# EasyEDA schematic SCH_usb_board_2025-01-15.json
TITLE: usb_board; REV: 1.0; Date: 2025-01-14; Sheet: 1/1; Company: Gymnazium Jana Keplera
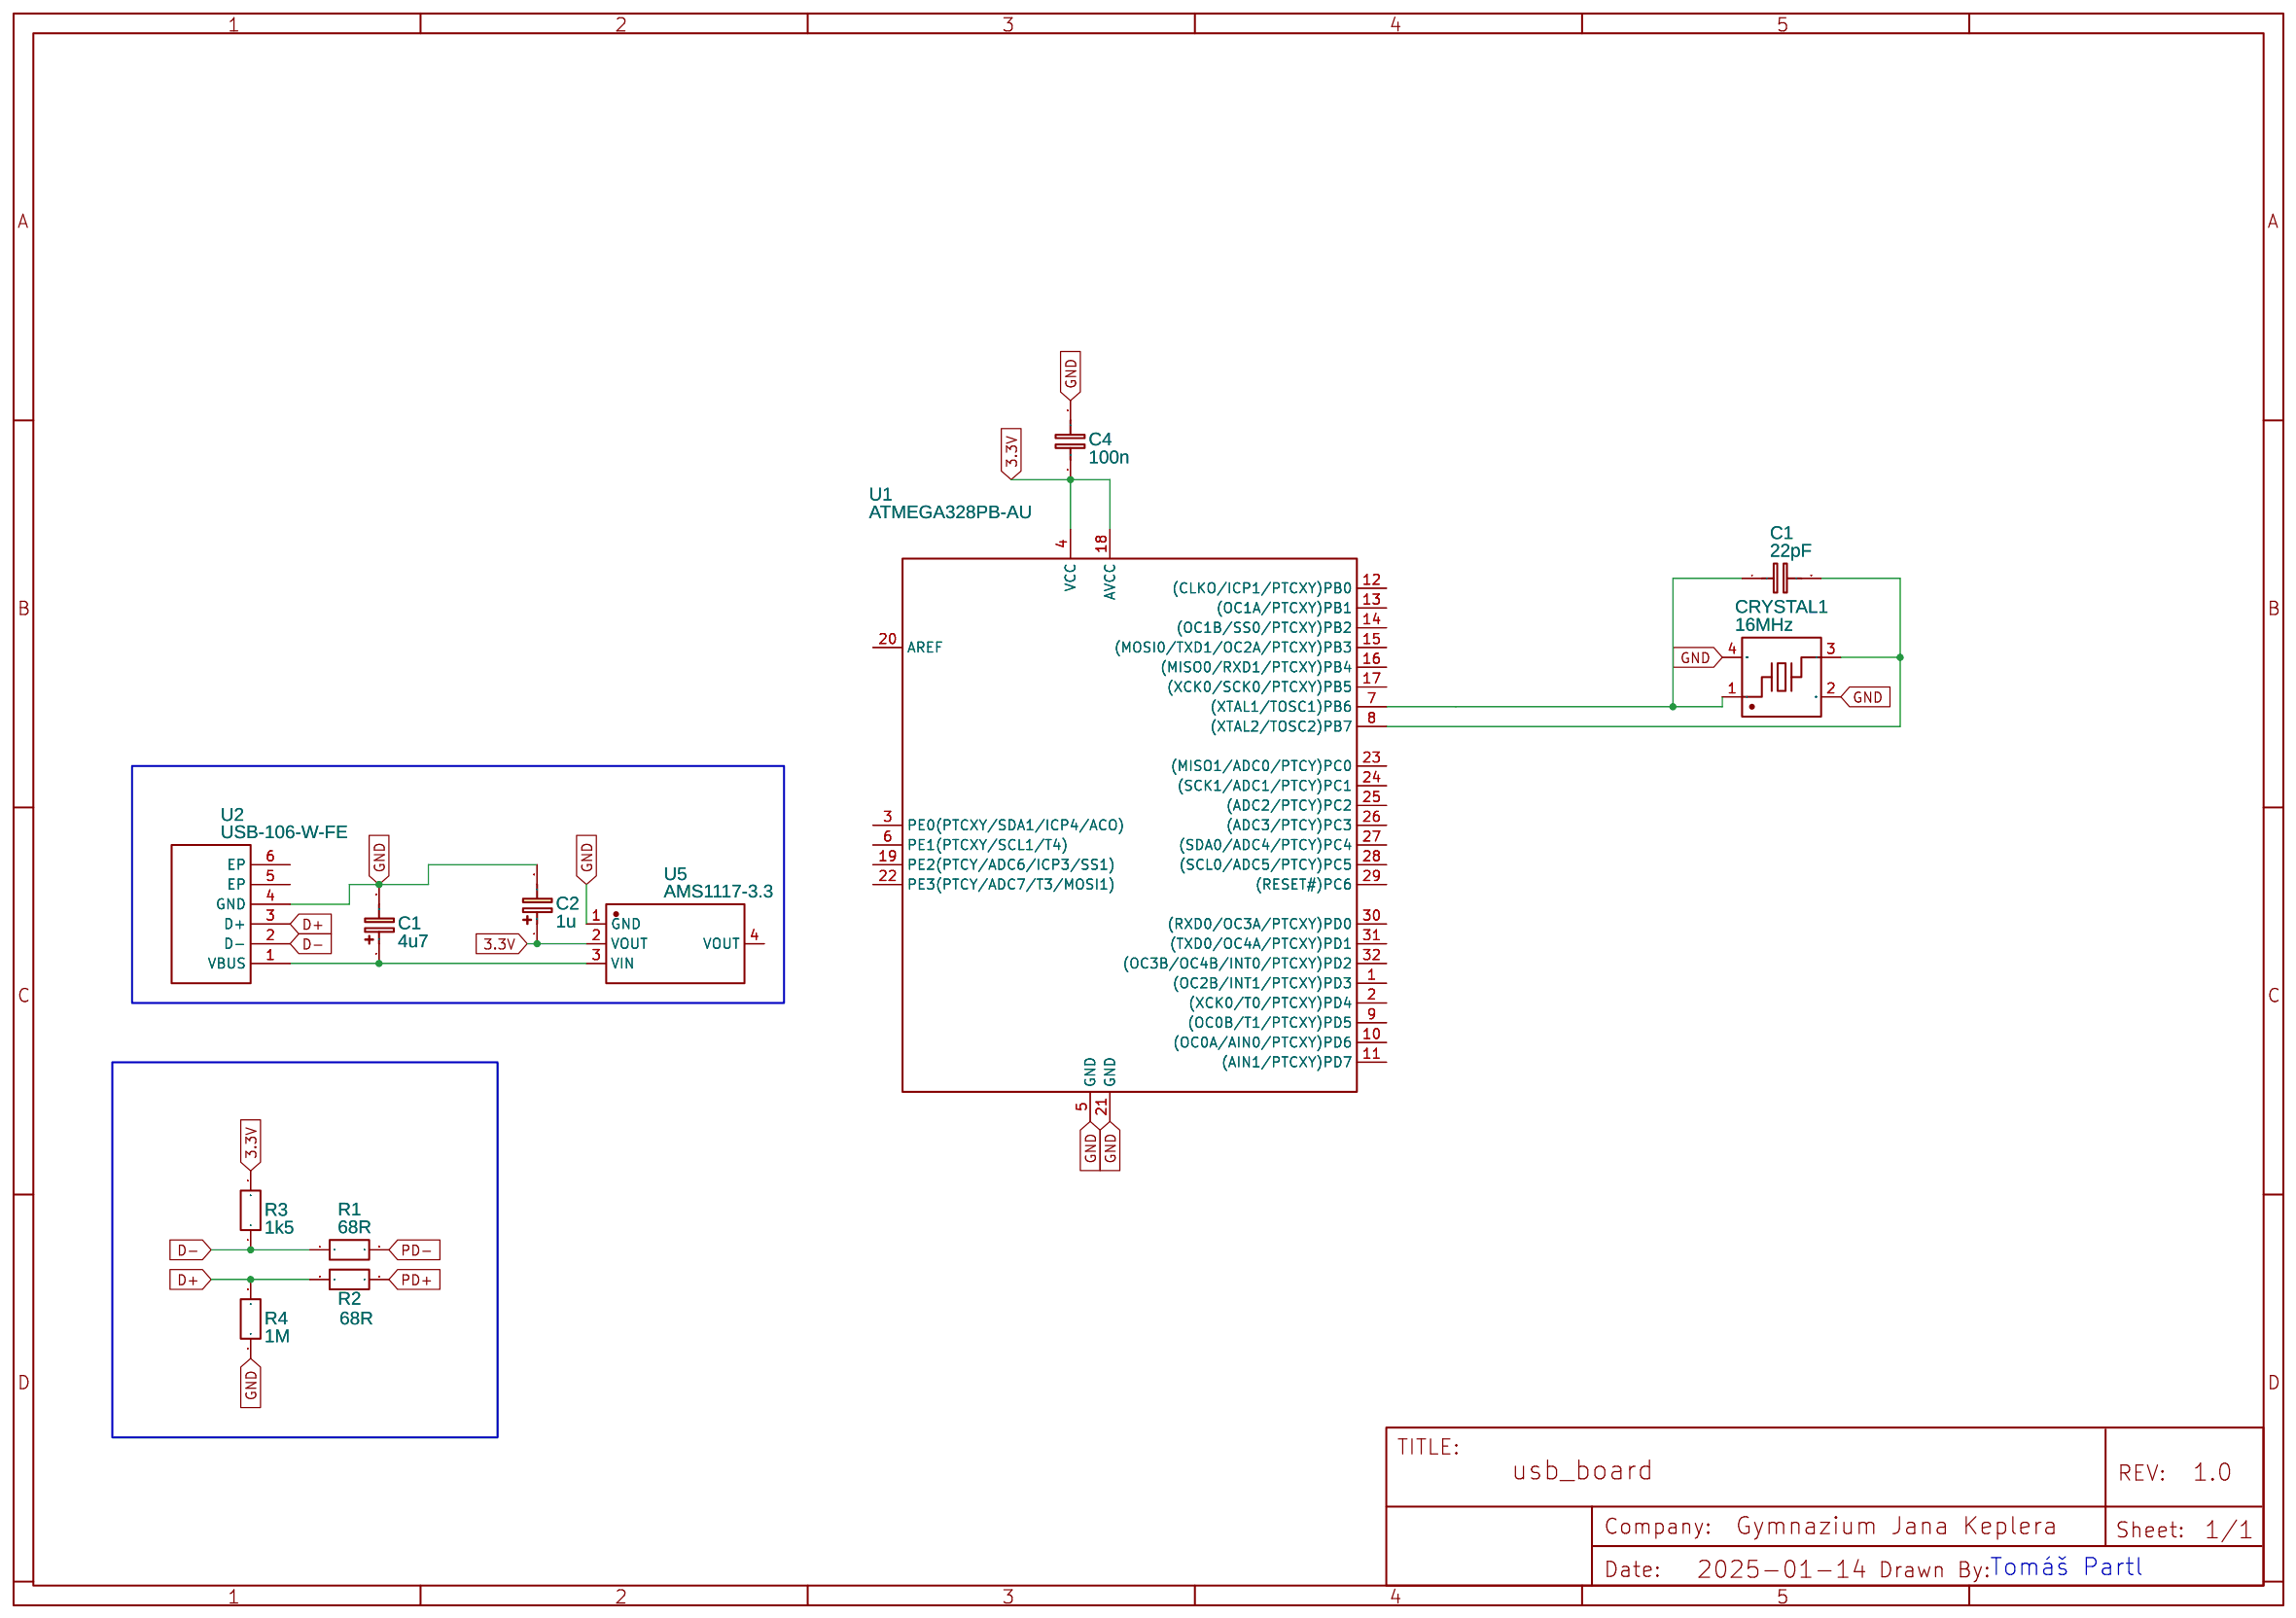
[diagram p0: schematic sheet]

## Parts
C1  22pF  [C0603]
C1#2  4u7  [CASE-A_3216]
C2  1u  [CASE-A_3216]
C4  100n  [C0603]
CRYSTAL1  16MHz  [CRYSTAL-SMD_4P-L2.5-W2.0-BL]
R1  68R  [R0603]
R2  68R  [R0603]
R3  1k5  [R0603]
R4  1M  [R0603]
U1  ATMEGA328PB-AU  [TQFP-32_L7.0-W7.0-P0.80-LS9.0-BL]
U2  USB-106-W-FE  [USB-A-TH_USB-106]
U5  AMS1117-3.3  [SOT-223-3_L6.5-W3.4-P2.30-LS7.0-BR]

## Library data of the parts
C1 C4 = C_0603_EU: Contributor: LCEDA_Lib
C1#2 C2 = C_Tan_SMD_A_EU: Contributor: LCEDA_Lib
CRYSTAL1 = CM4016M00010001: Supplier: LCSC; Supplier Part: C7294619; Manufacturer: HUAXIN(华昕); Contributor: lcsc
R1-R4 = R_0603_EU: Contributor: LCEDA_Lib
U1 = ATMEGA328PB-AU: Contributor: LCSC; Supplier: LCSC; Manufacturer: MICROCHIP(美国微芯); Supplier Part: C132230; JLCPCB Part Class: Extended Part
U2 = USB-106-W-FE: Contributor: lcsc; Supplier: LCSC; Supplier Part: C2939557; Manufacturer: HOOYA(皓宇电子)
U5 = AMS1117-3.3: sourceId: dwIGgezVh; Supplier: LCSC; Manufacturer: AMS; Supplier Part: C6186; JLCPCB Part Class: Basic Part

## Nets
3.3V: C2.1 C4.1 R3.2 U1.4(VCC) U1.18(AVCC) U5.2(VOUT)
GND: C1#2.2 C2.2 C4.2 CRYSTAL1.2(GND) CRYSTAL1.4(GND) R4.1 U1.5(GND) U1.21(GND) U2.4(GND) U5.1(GND)
D+: R2.1 R4.2 U2.3(D+)
D-: R1.1 R3.1 U2.2(D-)
PD+: R2.2
PD-: R1.2
Net-(C1#2-1): C1#2.1 U2.1(VBUS) U5.3(VIN)
Net-(C1-1): C1.1 CRYSTAL1.1 U1.7((XTAL1/TOSC1)PB6)
Net-(C1-2): C1.2 CRYSTAL1.3 U1.8((XTAL2/TOSC2)PB7)

Not connected (* = marked no-connect by the designer): U1 1((OC2B/INT1/PTCXY)PD3) 2((XCK0/T0/PTCXY)PD4) 3(PE0(PTCXY/SDA1/ICP4/ACO)) 6(PE1(PTCXY/SCL1/T4)) 9((OC0B/T1/PTCXY)PD5) 10((OC0A/AIN0/PTCXY)PD6) 11((AIN1/PTCXY)PD7) 12((CLKO/ICP1/PTCXY)PB0) 13((OC1A/PTCXY)PB1) 14((OC1B/SS0/PTCXY)PB2) 15((MOSI0/TXD1/OC2A/PTCXY)PB3) 16((MISO0/RXD1/PTCXY)PB4) 17((XCK0/SCK0/PTCXY)PB5) 19(PE2(PTCY/ADC6/ICP3/SS1)) 20(AREF) 22(PE3(PTCY/ADC7/T3/MOSI1)) 23((MISO1/ADC0/PTCY)PC0) 24((SCK1/ADC1/PTCY)PC1) 25((ADC2/PTCY)PC2) 26((ADC3/PTCY)PC3) 27((SDA0/ADC4/PTCY)PC4) 28((SCL0/ADC5/PTCY)PC5) 29((RESET#)PC6) 30((RXD0/OC3A/PTCXY)PD0) 31((TXD0/OC4A/PTCXY)PD1) 32((OC3B/OC4B/INT0/PTCXY)PD2); U2 5(EP) 6(EP); U5 4(VOUT)

## Notes on the sheet
- Tomáš Partl
